# Altium schematic sheet TYPK.SchDoc
size A3
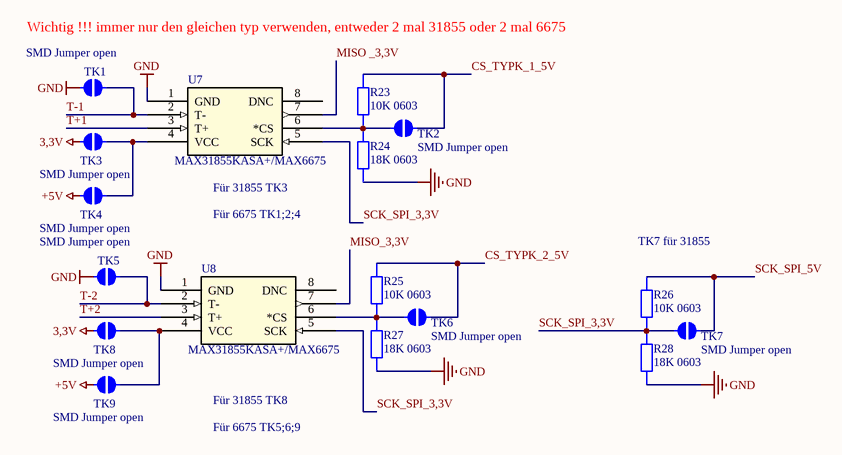
[diagram p0: TYPK.SchDoc]

## Parts
R23  value 10K 0603  [STACKPOLE CSR0603]  (hidden comment: SMD Resistor)
R24  value 18K 0603  [STACKPOLE CSR0603]  (hidden comment: SMD Resistor)
R25  value 10K 0603  [STACKPOLE CSR0603]  (hidden comment: SMD Resistor)
R26  value 10K 0603  [STACKPOLE CSR0603]  (hidden comment: SMD Resistor)
R27  value 18K 0603  [STACKPOLE CSR0603]  (hidden comment: SMD Resistor)
R28  value 18K 0603  [STACKPOLE CSR0603]  (hidden comment: SMD Resistor)
TK1  SMD Jumper open  [SMD-JUMPER-OPEN]  (no BOM)
TK2  SMD Jumper open  [SMD-JUMPER-OPEN]  (no BOM)
TK3  SMD Jumper open  [SMD-JUMPER-OPEN]  (no BOM)
TK4  SMD Jumper open  [SMD-JUMPER-OPEN]  (no BOM)
TK5  SMD Jumper open  [SMD-JUMPER-OPEN]  (no BOM)
TK6  SMD Jumper open  [SMD-JUMPER-OPEN]  (no BOM)
TK7  SMD Jumper open  [SMD-JUMPER-OPEN]  (no BOM)
TK8  SMD Jumper open  [SMD-JUMPER-OPEN]  (no BOM)
TK9  SMD Jumper open  [SMD-JUMPER-OPEN]  (no BOM)
U7  MAX31855KASA+/MAX6675  [SOIC8]
U8  MAX31855KASA+/MAX6675  [SOIC8]

## Nets
3,3V: TK3.1 TK8.1
+5V: TK4.1 TK9.1
GND: R24.1 R27.1 R28.1 TK1.1 TK5.1 U7.1(GND) U8.1(GND)
CS_TYPK_1_5V: R23.2 TK2.2
CS_TYPK_2_5V: R25.2 TK6.2
MISO _3,3V: U7.7(SO)
MISO_3,3V: U8.7(SO)
SCK_SPI_3,3V: R26.1 R28.2 TK7.1 U7.5(SCK) U8.5(SCK)
SCK_SPI_5V: R26.2 TK7.2
T+1: U7.3(T+)
T+2: U8.3(T+)
T-1: TK1.2 U7.2(T-)
T-2: TK5.2 U8.2(T-)
NetR23_1: R23.1 R24.2 TK2.1 U7.6(*CS)
NetR25_1: R25.1 R27.2 TK6.1 U8.6(*CS)
NetTK3_2: TK3.2 TK4.2 U7.4(VCC)
NetTK8_2: TK8.2 TK9.2 U8.4(VCC)

Not connected (* = marked no-connect by the designer): U7 8(DNC); U8 8(DNC)

## Notes on the sheet
- Wichtig !!! immer nur den gleichen typ verwenden, entweder 2 mal 31855 oder 2 mal 6675
- (near U7) Für 31855 TK3
- Für 6675 TK1;2;4
- (near R26) TK7 für 31855
- Für 31855 TK8
- Für 6675 TK5;6;9

## Library data of the parts
R23-R28 = SMD Resistor: Resistor with multiple footprints
U7 U8 = MAX31855KASA+: No Description Available; Vendor: Maxim Integrated Products; Built_By: EMA_UL_Team; Manufacturer_Part_Number: MAX31855KASA+; Copyright: Copyright (C) 2018 Accelerated Designs. All rights reserved; RefDes: RefDes; Type: DEV; Value: Value